# EAGLE design Electrotactile_Schematic (EAGLE 9.6.2)
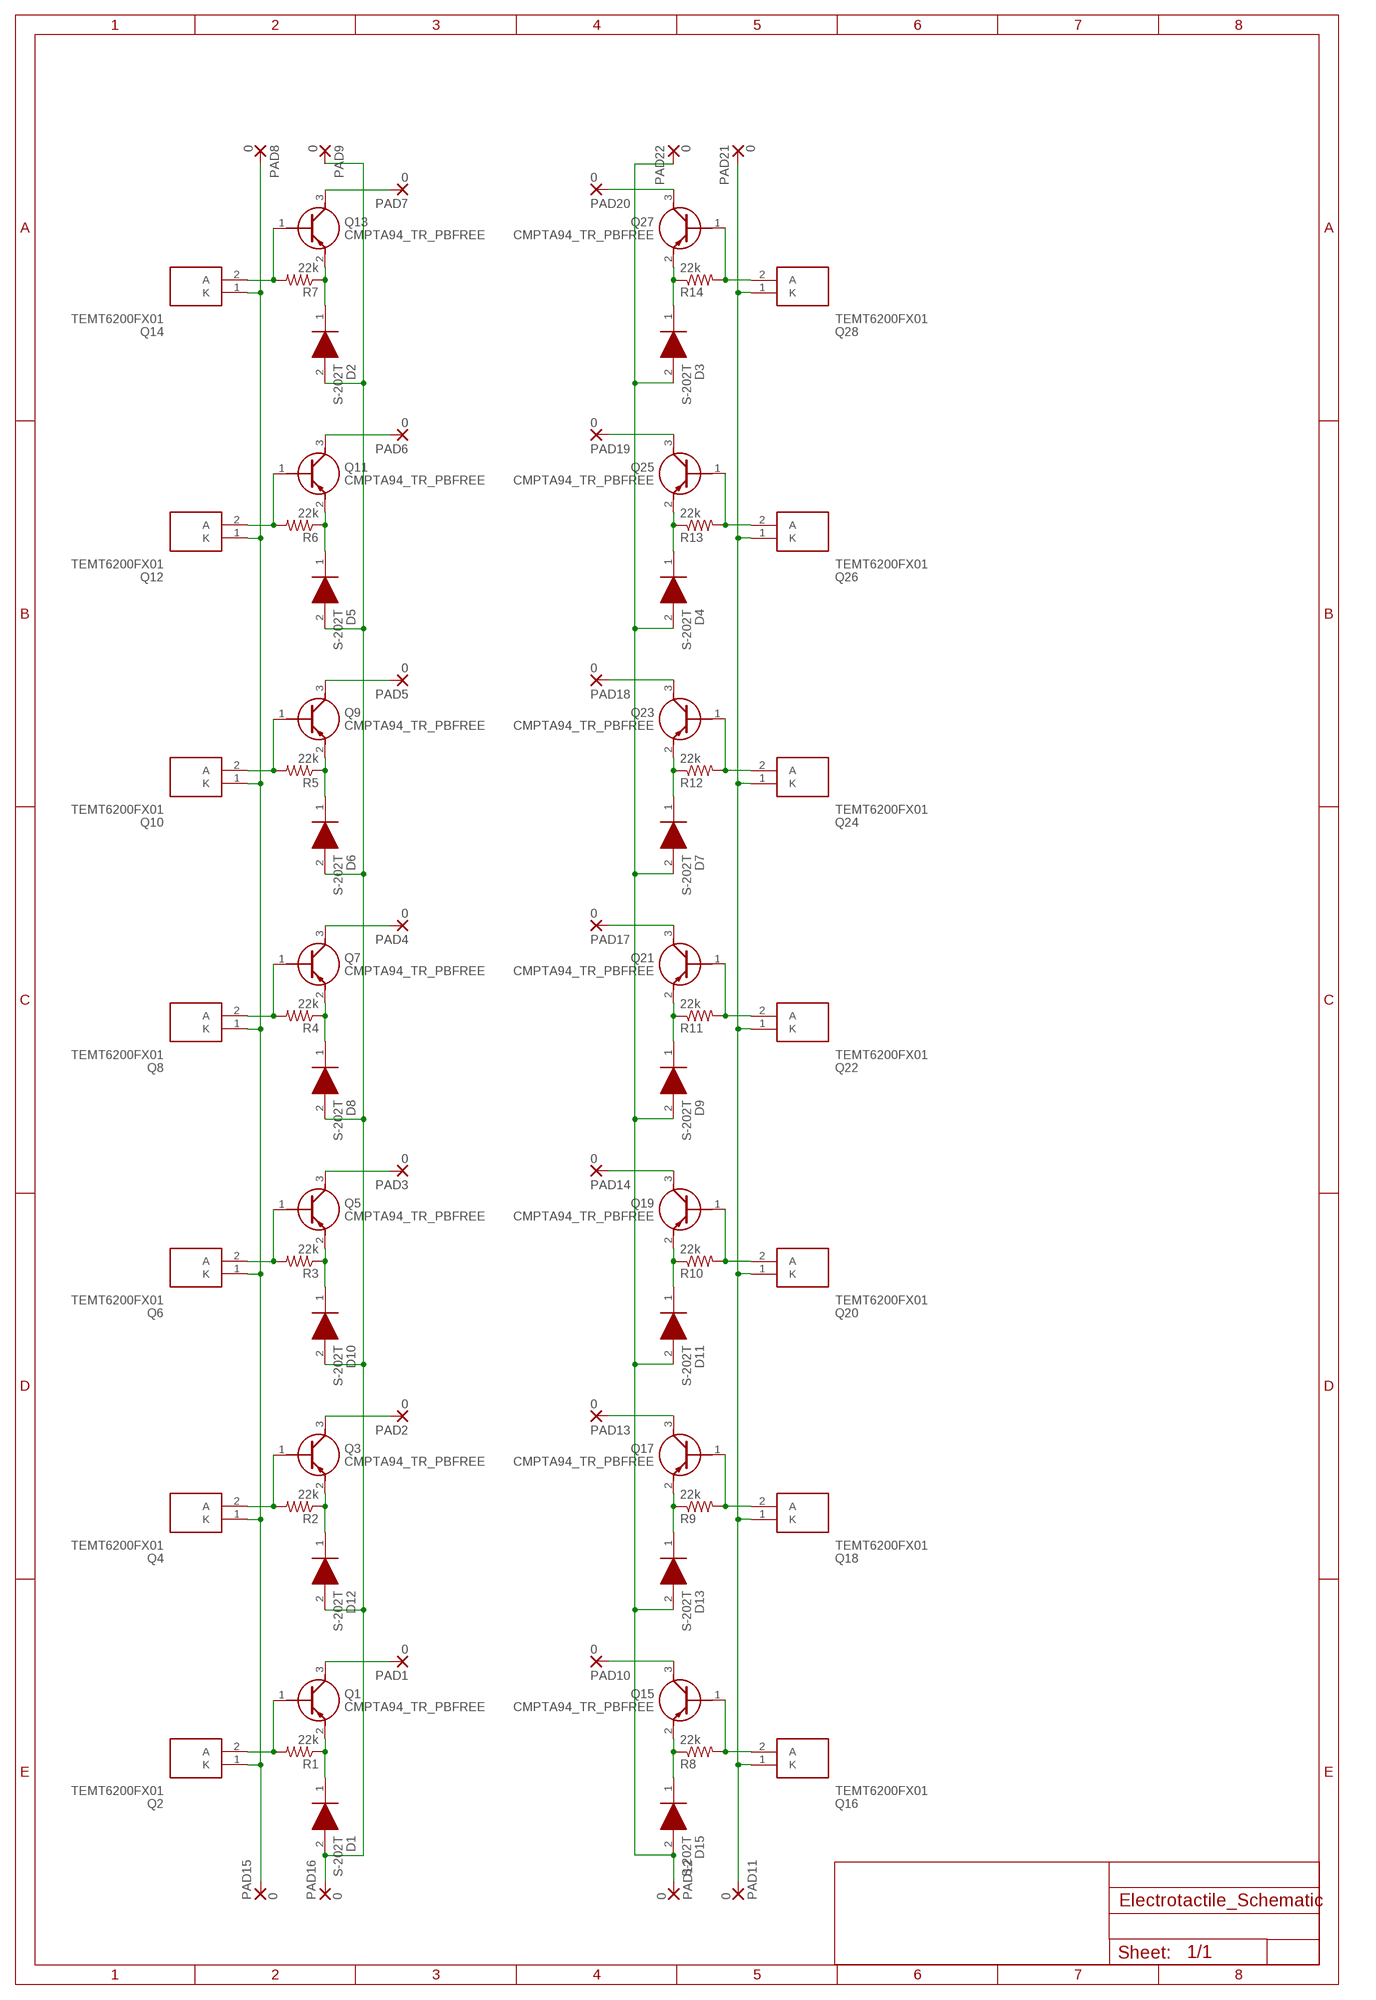
[diagram p0: schematic, sheet 1]

## Parts
D1  S-202T  [SODFL3516X70N]
D2  S-202T  [SODFL3516X70N]
D3  S-202T  [SODFL3516X70N]
D4  S-202T  [SODFL3516X70N]
D5  S-202T  [SODFL3516X70N]
D6  S-202T  [SODFL3516X70N]
D7  S-202T  [SODFL3516X70N]
D8  S-202T  [SODFL3516X70N]
D9  S-202T  [SODFL3516X70N]
D10  S-202T  [SODFL3516X70N]
D11  S-202T  [SODFL3516X70N]
D12  S-202T  [SODFL3516X70N]
D13  S-202T  [SODFL3516X70N]
D15  S-202T  [SODFL3516X70N]
PAD1  0  1,6/0,8  [1,6/0,8]
PAD2  0  1,6/0,8  [1,6/0,8]
PAD3  0  1,6/0,8  [1,6/0,8]
PAD4  0  1,6/0,8  [1,6/0,8]
PAD5  0  1,6/0,8  [1,6/0,8]
PAD6  0  1,6/0,8  [1,6/0,8]
PAD7  0  1,6/0,8  [1,6/0,8]
PAD8  0  1,6/0,8  [1,6/0,8]
PAD9  0  1,6/0,8  [1,6/0,8]
PAD10  0  1,6/0,8  [1,6/0,8]
PAD11  0  1,6/0,8  [1,6/0,8]
PAD12  0  1,6/0,8  [1,6/0,8]
PAD13  0  1,6/0,8  [1,6/0,8]
PAD14  0  1,6/0,8  [1,6/0,8]
PAD15  0  1,6/0,8  [1,6/0,8]
PAD16  0  1,6/0,8  [1,6/0,8]
PAD17  0  1,6/0,8  [1,6/0,8]
PAD18  0  1,6/0,8  [1,6/0,8]
PAD19  0  1,6/0,8  [1,6/0,8]
PAD20  0  1,6/0,8  [1,6/0,8]
PAD21  0  1,6/0,8  [1,6/0,8]
PAD22  0  1,6/0,8  [1,6/0,8]
Q1  CMPTA94_TR_PBFREE  [SOT95P230X109-3N]
Q2  TEMT6200FX01  [LEDC2012X95N]
Q3  CMPTA94_TR_PBFREE  [SOT95P230X109-3N]
Q4  TEMT6200FX01  [LEDC2012X95N]
Q5  CMPTA94_TR_PBFREE  [SOT95P230X109-3N]
Q6  TEMT6200FX01  [LEDC2012X95N]
Q7  CMPTA94_TR_PBFREE  [SOT95P230X109-3N]
Q8  TEMT6200FX01  [LEDC2012X95N]
Q9  CMPTA94_TR_PBFREE  [SOT95P230X109-3N]
Q10  TEMT6200FX01  [LEDC2012X95N]
Q11  CMPTA94_TR_PBFREE  [SOT95P230X109-3N]
Q12  TEMT6200FX01  [LEDC2012X95N]
Q13  CMPTA94_TR_PBFREE  [SOT95P230X109-3N]
Q14  TEMT6200FX01  [LEDC2012X95N]
Q15  CMPTA94_TR_PBFREE  [SOT95P230X109-3N]
Q16  TEMT6200FX01  [LEDC2012X95N]
Q17  CMPTA94_TR_PBFREE  [SOT95P230X109-3N]
Q18  TEMT6200FX01  [LEDC2012X95N]
Q19  CMPTA94_TR_PBFREE  [SOT95P230X109-3N]
Q20  TEMT6200FX01  [LEDC2012X95N]
Q21  CMPTA94_TR_PBFREE  [SOT95P230X109-3N]
Q22  TEMT6200FX01  [LEDC2012X95N]
Q23  CMPTA94_TR_PBFREE  [SOT95P230X109-3N]
Q24  TEMT6200FX01  [LEDC2012X95N]
Q25  CMPTA94_TR_PBFREE  [SOT95P230X109-3N]
Q26  TEMT6200FX01  [LEDC2012X95N]
Q27  CMPTA94_TR_PBFREE  [SOT95P230X109-3N]
Q28  TEMT6200FX01  [LEDC2012X95N]
R1  22k  R-US_R0805  [R0805]
R2  22k  R-US_R0805  [R0805]
R3  22k  R-US_R0805  [R0805]
R4  22k  R-US_R0805  [R0805]
R5  22k  R-US_R0805  [R0805]
R6  22k  R-US_R0805  [R0805]
R7  22k  R-US_R0805  [R0805]
R8  22k  R-US_R0805  [R0805]
R9  22k  R-US_R0805  [R0805]
R10  22k  R-US_R0805  [R0805]
R11  22k  R-US_R0805  [R0805]
R12  22k  R-US_R0805  [R0805]
R13  22k  R-US_R0805  [R0805]
R14  22k  R-US_R0805  [R0805]

## Nets
N$1: Q15.1(B) Q16.2(A) R8.2
N$2: D3.1(K) Q27.2(E) R14.1
N$3: Q1.1(B) Q2.2(A) R1.2
N$4: PAD1.1(P) Q1.3(C)
N$5: Q3.1(B) Q4.2(A) R2.2
N$6: PAD2.1(P) Q3.3(C)
N$7: D6.1(K) Q9.2(E) R5.1
N$8: PAD10.1(P) Q15.3(C)
N$9: D3.2(A) D4.2(A) D7.2(A) D9.2(A) D11.2(A) D13.2(A) D15.2(A) PAD12.1(P) PAD22.1(P)
N$10: PAD8.1(P) PAD15.1(P) Q2.1(K) Q4.1(K) Q6.1(K) Q8.1(K) Q10.1(K) Q12.1(K) Q14.1(K)
N$11: Q5.1(B) Q6.2(A) R3.2
N$12: PAD3.1(P) Q5.3(C)
N$13: D10.1(K) Q5.2(E) R3.1
N$14: Q17.1(B) Q18.2(A) R9.2
N$15: PAD13.1(P) Q17.3(C)
N$16: Q7.1(B) Q8.2(A) R4.2
N$17: PAD4.1(P) Q7.3(C)
N$18: D5.1(K) Q11.2(E) R6.1
N$20: PAD11.1(P) PAD21.1(P) Q16.1(K) Q18.1(K) Q20.1(K) Q22.1(K) Q24.1(K) Q26.1(K) Q28.1(K)
N$21: Q9.1(B) Q10.2(A) R5.2
N$22: PAD5.1(P) Q9.3(C)
N$23: D8.1(K) Q7.2(E) R4.1
N$24: Q19.1(B) Q20.2(A) R10.2
N$25: PAD14.1(P) Q19.3(C)
N$26: Q11.1(B) Q12.2(A) R6.2
N$27: PAD6.1(P) Q11.3(C)
N$28: D1.1(K) Q1.2(E) R1.1
N$29: D13.1(K) Q17.2(E) R9.1
N$30: Q21.1(B) Q22.2(A) R11.2
N$31: Q13.1(B) Q14.2(A) R7.2
N$32: PAD7.1(P) Q13.3(C)
N$33: D2.1(K) Q13.2(E) R7.1
N$34: D1.2(A) D2.2(A) D5.2(A) D6.2(A) D8.2(A) D10.2(A) D12.2(A) PAD9.1(P) PAD16.1(P)
N$35: PAD17.1(P) Q21.3(C)
N$36: D11.1(K) Q19.2(E) R10.1
N$37: Q23.1(B) Q24.2(A) R12.2
N$38: PAD18.1(P) Q23.3(C)
N$39: D9.1(K) Q21.2(E) R11.1
N$40: Q25.1(B) Q26.2(A) R13.2
N$41: PAD19.1(P) Q25.3(C)
N$42: D7.1(K) Q23.2(E) R12.1
N$43: Q27.1(B) Q28.2(A) R14.2
N$44: PAD20.1(P) Q27.3(C)
N$45: D4.1(K) Q25.2(E) R13.1
N$46: D15.1(K) Q15.2(E) R8.1
N$47: D12.1(K) Q3.2(E) R2.1

## Library data of the parts
D1-D13 D15 = SamacSys_Parts:S-202T: Current Regulator Diodes 100V 2mA Source: Datasheet <https://componentsearchengine.com/Datasheets/1/S-202T.pdf>; DESCRIPTION: Current Regulator Diodes 100V 2mA; HEIGHT: 0.7mm; MANUFACTURER_NAME: Semitec; MANUFACTURER_PART_NUMBER: S-202T; MOUSER_PART_NUMBER: 954-S-202T; MOUSER_PRICE-STOCK: https://www.mouser.co.uk/ProductDetail/Semitec/S-202T?qs=wgO0AD0o1vtit2%2F0lYGcqA%3D%3D
PAD1-PAD22 = wirepad:1,6/0,8: THROUGH-HOLE PAD
Q1 Q3 Q5 Q7 Q9 Q11 Q13 Q15 Q17 Q19 Q21 Q23 Q25 Q27 = SamacSys_Parts:CMPTA94_TR_PBFREE: Bipolar Transistors - BJT PNP HV Trans 400Vcbo 400Vceo 6.0ebo 350mW Source: Datasheet; DESCRIPTION: Bipolar Transistors - BJT PNP HV Trans 400Vcbo 400Vceo 6.0ebo 350mW; HEIGHT: 1.09mm; MANUFACTURER_NAME: Central Semiconductor; MANUFACTURER_PART_NUMBER: CMPTA94 TR PBFREE
Q2 Q4 Q6 Q8 Q10 Q12 Q14 Q16 Q18 Q20 Q22 Q24 Q26 Q28 = SamacSys_Parts:TEMT6200FX01: Vishay TEMT6200FX01 120 Visible Light Phototransistor Surface Mount SMD Package Source: Datasheet <https://componentsearchengine.com/Datasheets/2/TEMT6200FX01.pdf>; DESCRIPTION: Vishay TEMT6200FX01 120 Visible Light Phototransistor Surface Mount SMD Package; HEIGHT: 0.95mm; MANUFACTURER_NAME: Vishay; MANUFACTURER_PART_NUMBER: TEMT6200FX01; MOUSER_PART_NUMBER: 782-TEMT6200F; MOUSER_PRICE-STOCK: https://www.mouser.co.uk/ProductDetail/Vishay-Semiconductors/TEMT6200FX01/?qs=%2Fjqivxn91cdDbKNzRLtBUw%3D%3D
R1-R14 = rcl:R-US_: RESISTOR, American symbol; SPICEPREFIX: R

## Board
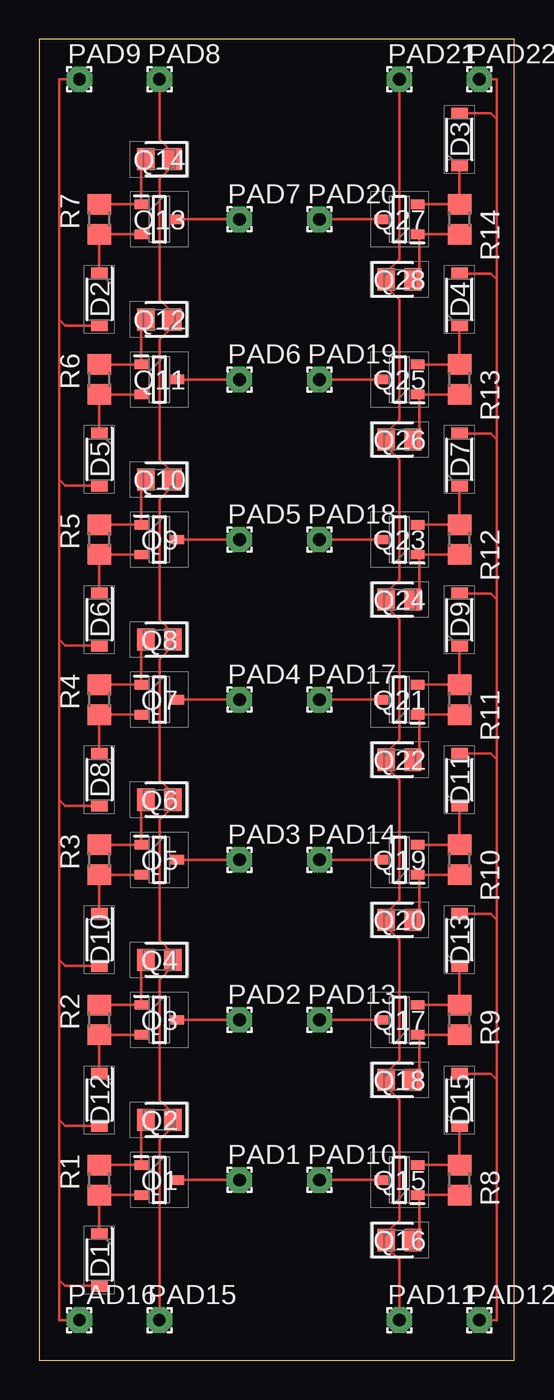
[diagram p1: board, top side]

Size 30.15 x 83.81 mm. Coordinates in mm from the lower left corner, seen from the top.
Outline: 0,0 30.15,0 30.15,83.81 0,83.81 0,0
Copper layers (1*16): Top 0.035mm / dielectric 1.5mm / Bottom 0.035mm
Design rules "default": minimum track width 6mil, minimum drill 0.35mm, track to track 6mil, track to pad 6mil, pad to pad 6mil, via to via 6mil, smd to smd 6mil, copper to edge 40mil, drill to drill 6mil, minimum pad ring 10mil, minimum via ring 8mil, stop-mask expansion 4mil, vias tented up to drill 0mil, thermal gap 10mil

### Footprints (pad centres in the part's own frame; a part is rotated, then mirrored left to right if it is on the bottom)
SODFL3516X70N = smd 0.74 x 1.04: 1 -1.65,0; 2 1.65,0
1,6/0,8 = drill 0.813 pad 1.6 octagon: 1 0,0
SOT95P230X109-3N = smd 0.85 x 0.6: 1 -1.15,0.95; 2 -1.15,-0.95; 3 1.15,0
LEDC2012X95N = smd 1.1 x 1.4: 1 -0.85,0; 2 0.85,0
R0805 = smd 1.3 x 1.5: 1 -0.95,0; 2 0.95,0

### Placement (x,y rotation side)
D1  3.81,6.35 270 top
D2  3.81,67.31 270 top
D3  26.67,77.47 90 top
D4  26.67,67.31 90 top
D5  3.81,57.15 270 top
D6  3.81,46.99 270 top
D7  26.67,57.15 90 top
D8  3.81,36.83 270 top
D9  26.67,46.99 90 top
D10  3.81,26.67 270 top
D11  26.67,36.83 90 top
D12  3.81,16.51 270 top
D13  26.67,26.67 90 top
D15  26.67,16.51 90 top
PAD1  12.7,11.43 0 top
PAD2  12.7,21.59 0 top
PAD3  12.7,31.75 0 top
PAD4  12.7,41.91 0 top
PAD5  12.7,52.07 0 top
PAD6  12.7,62.23 0 top
PAD7  12.7,72.39 0 top
PAD8  7.62,81.28 0 top
PAD9  2.54,81.28 0 top
PAD10  17.78,11.43 0 top
PAD11  22.86,2.54 0 top
PAD12  27.94,2.54 0 top
PAD13  17.78,21.59 0 top
PAD14  17.78,31.75 0 top
PAD15  7.62,2.54 0 top
PAD16  2.54,2.54 0 top
PAD17  17.78,41.91 0 top
PAD18  17.78,52.07 0 top
PAD19  17.78,62.23 0 top
PAD20  17.78,72.39 0 top
PAD21  22.86,81.28 0 top
PAD22  27.94,81.28 0 top
Q1  7.62,11.43 0 top
Q2  7.62,15.24 180 top
Q3  7.62,21.59 0 top
Q4  7.62,25.4 180 top
Q5  7.62,31.75 0 top
Q6  7.62,35.56 180 top
Q7  7.62,41.91 0 top
Q8  7.62,45.72 180 top
Q9  7.62,52.07 0 top
Q10  7.62,55.88 180 top
Q11  7.62,62.23 0 top
Q12  7.62,66.04 180 top
Q13  7.62,72.39 0 top
Q14  7.62,76.2 180 top
Q15  22.86,11.43 180 top
Q16  22.86,7.62 0 top
Q17  22.86,21.59 180 top
Q18  22.86,17.78 0 top
Q19  22.86,31.75 180 top
Q20  22.86,27.94 0 top
Q21  22.86,41.91 180 top
Q22  22.86,38.1 0 top
Q23  22.86,52.07 180 top
Q24  22.86,48.26 0 top
Q25  22.86,62.23 180 top
Q26  22.86,58.42 0 top
Q27  22.86,72.39 180 top
Q28  22.86,68.58 0 top
R1  3.81,11.43 90 top
R2  3.81,21.59 90 top
R3  3.81,31.75 90 top
R4  3.81,41.91 90 top
R5  3.81,52.07 90 top
R6  3.81,62.23 90 top
R7  3.81,72.39 90 top
R8  26.67,11.43 270 top
R9  26.67,21.59 270 top
R10  26.67,31.75 270 top
R11  26.67,41.91 270 top
R12  26.67,52.07 270 top
R13  26.67,62.23 270 top
R14  26.67,72.39 270 top

### Tracks (layer width: path | path; a pad name or v marks a point on that pad's centre or on a via)
N$1
  Top 0.152: R8.2 24.13,10.48 | 24.13,10.48 Q15.1 | Q16.2 24.13,8.04 24.13,10.48
N$2
  Top 0.152: Q27.2 R14.1 D3.1
N$3
  Top 0.152: Q2.2 6.47,14.94 Q1.1 R1.2
N$4
  Top 0.152: Q1.3 PAD1.1
N$5
  Top 0.152: Q4.2 6.47,25.1 Q3.1 R2.2
N$6
  Top 0.152: Q3.3 PAD2.1
N$7
  Top 0.152: R5.1 Q9.2 | R5.1 3.81,51.3 | R5.1 3.81,50.8 | R5.1 D6.1
N$8
  Top 0.152: Q15.3 PAD10.1
N$9
  Top 0.152: PAD12.1 29.06,2.54 29.06,17.78 | 29.06,17.78 29.06,27.94 | 29.06,27.94 29.06,38.1 | 29.06,38.1 29.06,48.26 | 29.06,48.26 29.06,58.42 | 29.06,58.42 29.06,68.58 | 29.06,68.58 29.06,78.74 | 29.06,78.74 29.06,81.28 PAD22.1 | D15.2 28.68,18.16 29.06,17.78 | D13.2 28.68,28.32 29.06,27.94 | D11.2 28.68,38.48 29.06,38.1 | D9.2 28.68,48.64 29.06,48.26 | D7.2 28.68,58.8 29.06,58.42 | D4.2 28.68,68.96 29.06,68.58 | D3.2 28.68,79.12 29.06,78.74
N$10
  Top 0.152: Q14.1 8.89,76.62 | Q14.1 8.47,75.78 7.62,74.93 7.62,67.31 8.89,66.04 | Q14.1 8.47,76.62 7.62,77.47 PAD8.1 | 8.89,66.04 Q12.1 | 8.89,66.04 7.62,64.77 7.62,57.15 8.89,55.88 Q10.1 8.47,55.46 7.62,54.61 7.62,46.99 8.47,46.14 Q8.1 8.47,45.3 7.62,44.45 7.62,36.83 8.89,35.56 | 8.89,35.56 Q6.1 | 8.89,35.56 7.62,34.29 7.62,26.67 8.47,25.82 Q4.1 8.47,24.98 7.62,24.13 7.62,16.51 8.89,15.24 | PAD15.1 7.62,13.97 8.89,15.24 | 8.89,15.24 Q2.1
N$11
  Top 0.152: Q6.2 6.47,35.26 Q5.1 R3.2
N$12
  Top 0.152: Q5.3 PAD3.1
N$13
  Top 0.152: R3.1 3.81,30.98 | Q5.2 R3.1 | 3.49,30.48 R3.1 | R3.1 D10.1
N$14
  Top 0.152: R9.2 24.13,20.64 | 24.13,20.64 Q17.1 | Q18.2 24.13,18.2 24.13,20.64
N$15
  Top 0.152: Q17.3 PAD13.1
N$16
  Top 0.152: Q8.2 6.47,45.42 Q7.1 R4.2
N$17
  Top 0.152: Q7.3 PAD4.1
N$18
  Top 0.152: R6.1 3.81,61.46 | R6.1 Q11.2 | 3.49,60.96 R6.1 | R6.1 D5.1
N$20
  Top 0.152: PAD21.1 22.86,69.85 21.59,68.58 Q28.1 22.01,68.16 22.86,67.31 22.86,59.69 21.59,58.42 Q26.1 22.01,58 22.86,57.15 22.86,49.53 21.59,48.26 Q24.1 22.01,47.84 22.86,46.99 22.86,39.37 21.59,38.1 Q22.1 22.01,37.68 22.86,36.83 22.86,29.21 21.59,27.94 Q20.1 22.01,27.52 22.86,26.67 22.86,19.05 21.59,17.78 Q18.1 22.01,17.36 22.86,16.51 22.86,8.89 21.59,7.62 Q16.1 22.01,7.2 22.86,6.35 PAD11.1
N$21
  Top 0.152: Q10.2 6.47,55.58 Q9.1 R5.2
N$22
  Top 0.152: Q9.3 PAD5.1
N$23
  Top 0.152: R4.1 Q7.2 | R4.1 3.81,41.14 | 3.49,40.64 R4.1 | R4.1 D8.1
N$24
  Top 0.152: R10.2 24.13,30.8 | 24.13,30.8 Q19.1 | Q20.2 24.13,28.36 24.13,30.8
N$25
  Top 0.152: Q19.3 PAD14.1
N$26
  Top 0.152: Q12.2 6.47,65.74 Q11.1 R6.2 4.13,63.5
N$27
  Top 0.152: Q11.3 PAD6.1
N$28
  Top 0.152: R1.1 Q1.2 | 3.81,10.66 R1.1 | 3.49,10.16 R1.1 | R1.1 D1.1
N$29
  Top 0.152: Q17.2 R9.1 D13.1
N$30
  Top 0.152: R11.2 24.13,40.96 | 24.13,40.96 Q21.1 | Q22.2 24.13,38.52 24.13,40.96
N$31
  Top 0.152: Q14.2 6.47,75.9 Q13.1 R7.2
N$32
  Top 0.152: Q13.3 PAD7.1
N$33
  Top 0.152: R7.1 Q13.2 | R7.1 3.81,71.62 | 3.49,71.12 R7.1 | D2.1 R7.1
N$34
  Top 0.152: PAD9.1 1.27,81.28 1.27,66.04 | 1.27,66.04 1.27,55.88 | 1.27,55.88 1.27,45.72 | 1.27,45.72 1.27,35.56 | 1.27,35.56 1.27,25.4 | 1.27,25.4 1.27,15.24 | 1.27,15.24 1.27,5.08 | 1.27,5.08 1.27,2.54 PAD16.1 | D1.2 1.65,4.7 1.27,5.08 | D12.2 1.65,14.86 1.27,15.24 | D10.2 1.65,25.02 1.27,25.4 | D8.2 1.65,35.18 1.27,35.56 | D6.2 1.65,45.34 1.27,45.72 | D5.2 1.65,55.5 1.27,55.88 | D2.2 1.65,65.66 1.27,66.04
N$35
  Top 0.152: Q21.3 PAD17.1
N$36
  Top 0.152: Q19.2 R10.1 D11.1
N$37
  Top 0.152: R12.2 24.13,51.12 | 24.13,51.12 Q23.1 | Q24.2 24.13,48.68 24.13,51.12
N$38
  Top 0.152: Q23.3 PAD18.1
N$39
  Top 0.152: Q21.2 R11.1 D9.1
N$40
  Top 0.152: R13.2 24.13,61.28 | 24.13,61.28 Q25.1 | Q26.2 24.13,58.84 24.13,61.28
N$41
  Top 0.152: Q25.3 PAD19.1
N$42
  Top 0.152: Q23.2 R12.1 D7.1
N$43
  Top 0.152: 23.71,71.74 Q27.1 24.13,71.44 | R14.2 24.13,71.44 | Q28.2 24.13,69 24.13,71.44
N$44
  Top 0.152: Q27.3 PAD20.1
N$45
  Top 0.152: Q25.2 R13.1 D4.1
N$46
  Top 0.152: Q15.2 R8.1 D15.1
N$47
  Top 0.152: R2.1 Q3.2 | R2.1 3.81,20.82 | 3.49,20.32 R2.1 | R2.1 D12.1